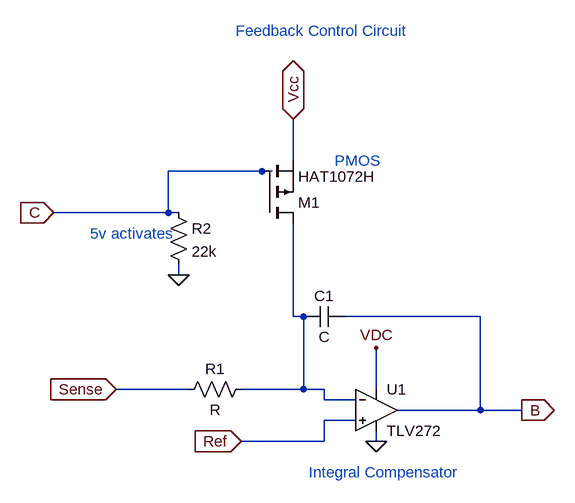
[diagram p0: schematic Integral_compensator.asc]
Integral_compensator.asc, the LTspice schematic file:
Version 4
SHEET 1 880 680
WIRE 160 16 160 -48
WIRE 112 32 -32 32
WIRE 128 32 112 32
WIRE -32 96 -32 32
WIRE -32 96 -208 96
WIRE -16 96 -32 96
WIRE -16 192 -16 176
WIRE 160 256 160 112
WIRE 176 256 160 256
WIRE 192 256 176 256
WIRE 448 256 240 256
WIRE 0 368 -112 368
WIRE 176 368 176 256
WIRE 176 368 80 368
WIRE 208 368 176 368
WIRE 288 368 288 304
WIRE 208 384 208 368
WIRE 256 384 208 384
WIRE 448 400 448 256
WIRE 448 400 320 400
WIRE 512 400 448 400
WIRE 256 416 208 416
WIRE 208 448 208 416
WIRE 208 448 80 448
WIRE 288 448 288 432
FLAG 288 448 0
FLAG 80 448 Ref
IOPIN 80 448 In
FLAG -112 368 Sense
IOPIN -112 368 In
FLAG 512 400 B
IOPIN 512 400 Out
FLAG 288 304 VDC
FLAG -16 192 0
FLAG -208 96 C
IOPIN -208 96 In
FLAG 160 -48 Vcc
IOPIN 160 -48 BiDir
SYMBOL TLV272 288 400 R0
SYMATTR InstName U1
SYMBOL res 96 352 R90
WINDOW 0 0 56 VBottom 2
WINDOW 3 32 56 VTop 2
SYMATTR InstName R1
SYMBOL cap 240 240 R90
WINDOW 0 0 32 VBottom 2
WINDOW 3 32 32 VTop 2
SYMATTR InstName C1
SYMBOL pmos 112 112 M180
SYMATTR InstName M1
SYMATTR Value HAT1072H
SYMBOL res -32 80 R0
SYMATTR InstName R2
SYMATTR Value 22k
TEXT -152 128 Left 2 ;5v activates
TEXT 224 16 Left 2 ;PMOS
TEXT 184 496 Left 2 ;Integral Compensator
TEXT 72 -184 Left 2 ;Feedback Control Circuit

The netlist it stands for:
* Integral_compensator.asc
* U1: TLV272 (symbol TLV272 not available, pins judged from their places): In+=Ref In-=N001 V+=VDC V-=0 OUT=B
R1 N001 Sense R
C1 B N001 C
M1 N001 C Vcc Vcc HAT1072H
R2 C 0 22k
.model NMOS NMOS
.model PMOS PMOS
.lib standard.mos
* 5v activates
* PMOS
* Integral Compensator
* Feedback Control Circuit
.backanno
.end